# Altium schematic sheet MCU.SchDoc
size A4; SheetNumber: 4; SheetTotal: 9
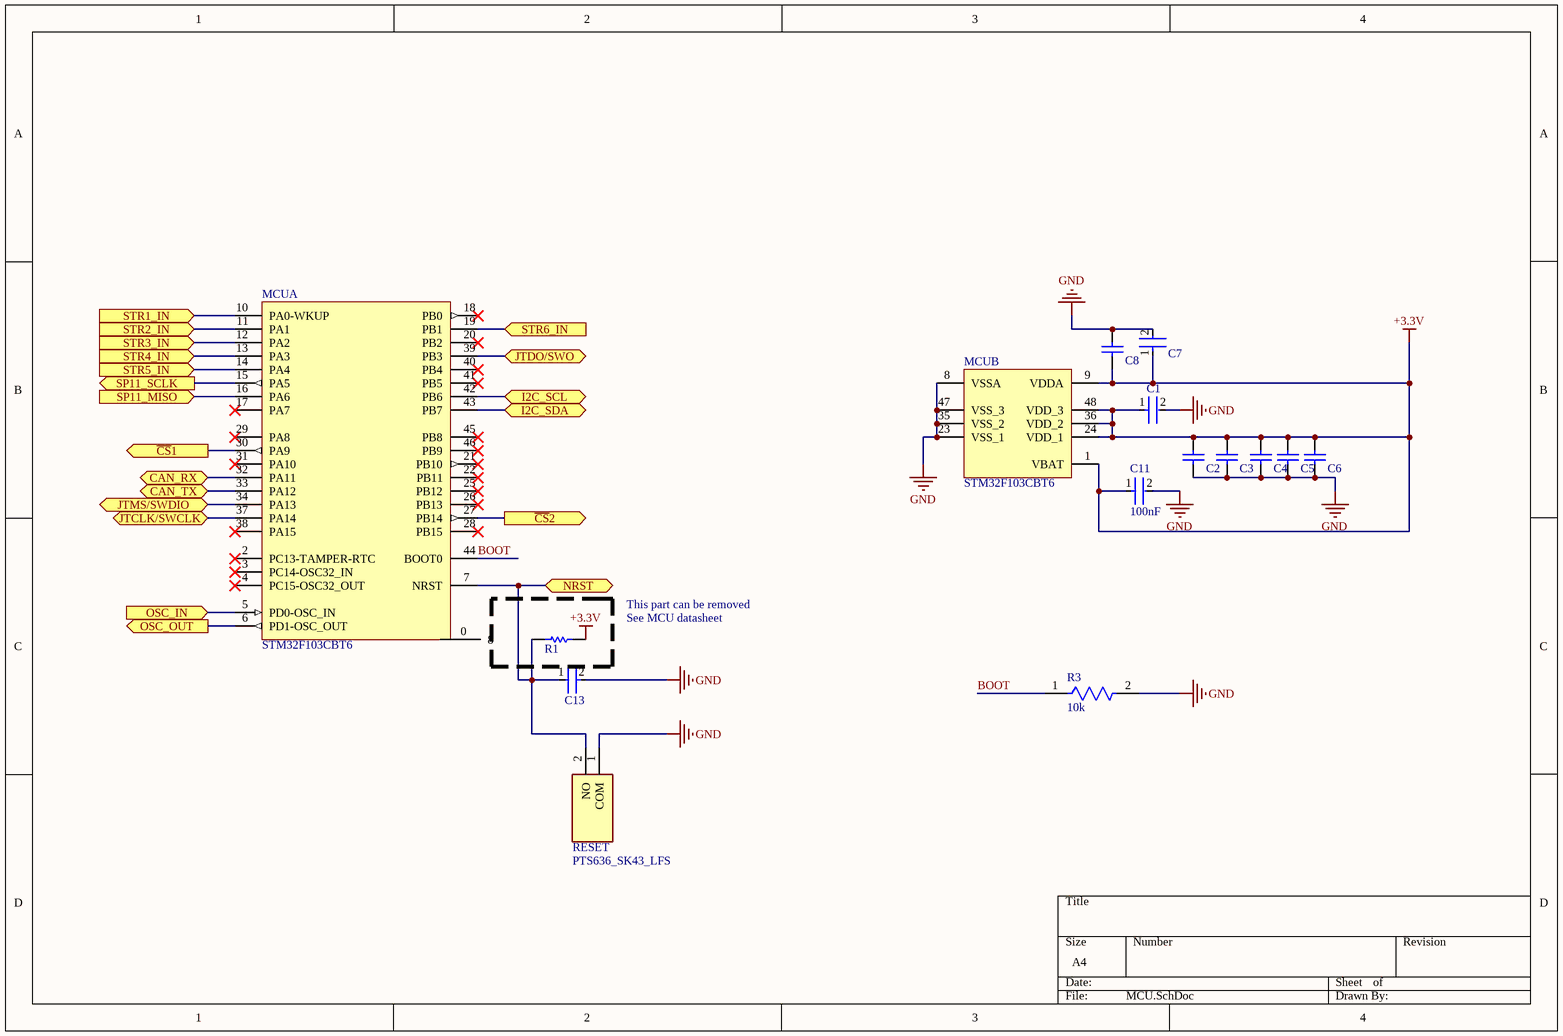
[diagram p0: MCU.SchDoc]

## Parts
C1  GRM155R60J475ME47D  [FP-GRM155-0_1-IPC_B]  (value not drawn)
C2  08051C104KAT2A  [CAPC2013X94X50ML20T25]  (value not drawn)
C3  08051C104KAT2A  [CAPC2013X94X50ML20T25]  (value not drawn)
C4  08051C104KAT2A  [CAPC2013X94X50ML20T25]  (value not drawn)
C5  08051C104KAT2A  [CAPC2013X94X50ML20T25]  (value not drawn)
C6  08051C104KAT2A  [CAPC2013X94X50ML20T25]  (value not drawn)
C7  GRM155R61A105KE15D  [FP-GRM15-0_1-MFG]  (value not drawn)
C8  08051C104KAT2A  [CAPC2013X94X50ML20T25]  (value not drawn)
C11  100nF  [FP-C0402-BB-MFG]
C13  GRM155R71C104KA88D  [FP-GRM15-MFG]  (value not drawn)
MCU  STM32F103CBT6  [STM-LQFP48_L]  (parts A,B of 2)
R1  CRCW12064K70FKEA  [RESC3216X60X45ML15T20]  (value not drawn)
R3  10k  [FP-CRCW0402-e3-IPC_B]
RESET  PTS636_SK43_LFS  [PTS636SK43LFS]

## Ports
CAN_RX (bidir), CAN_TX (bidir), I2C_SCL (bidir), I2C_SDA (bidir), JTCLK/SWCLK (bidir), JTDO/SWO (bidir), JTMS/SWDIO (bidir), NRST (bidir), OSC_IN (in), OSC_OUT (out), SP11_MISO (in), SP11_SCLK (out), STR1_IN (in), STR2_IN (in), STR3_IN (in), STR4_IN (in), STR5_IN (in), STR6_IN (in), ~{CS}1 (out), ~{CS}2 (out)

## Nets
+3.3V: C1.1 C2.2 C3.2 C4.2 C5.2 C6.2 C7.1 C8.2 C11.1 MCU.1(VBAT) MCU.9(VDDA) MCU.24(VDD_1) MCU.36(VDD_2) MCU.48(VDD_3) R1.2
GND: C1.2 C2.1 C3.1 C4.1 C5.1 C6.1 C7.2 C8.1 C11.2 C13.2 MCU.8(VSSA) MCU.23(VSS_1) MCU.35(VSS_2) MCU.47(VSS_3) R3.2 RESET.1(COM)
~{CS}1: MCU.30(PA9) ; port ~{CS}1
~{CS}2: MCU.27(PB14) ; port ~{CS}2
BOOT: MCU.44(BOOT0) R3.1
CAN_RX: MCU.32(PA11) ; port CAN_RX
CAN_TX: MCU.33(PA12) ; port CAN_TX
I2C_SCL: MCU.42(PB6) ; port I2C_SCL
I2C_SDA: MCU.43(PB7) ; port I2C_SDA
JTCLK/SWCLK: MCU.37(PA14) ; port JTCLK/SWCLK
JTDO/SWO: MCU.39(PB3) ; port JTDO/SWO
JTMS/SWDIO: MCU.34(PA13) ; port JTMS/SWDIO
NRST: C13.1 MCU.7(NRST) R1.1 RESET.2(NO) ; port NRST
OSC_IN: MCU.5(PD0-OSC_IN) ; port OSC_IN
OSC_OUT: MCU.6(PD1-OSC_OUT) ; port OSC_OUT
SP11_MISO: MCU.16(PA6) ; port SP11_MISO
SP11_SCLK: MCU.15(PA5) ; port SP11_SCLK
STR1_IN: MCU.10(PA0-WKUP) ; port STR1_IN
STR2_IN: MCU.11(PA1) ; port STR2_IN
STR3_IN: MCU.12(PA2) ; port STR3_IN
STR4_IN: MCU.13(PA3) ; port STR4_IN
STR5_IN: MCU.14(PA4) ; port STR5_IN
STR6_IN: MCU.19(PB1) ; port STR6_IN

Not connected (* = marked no-connect by the designer): MCU 0(8) 2(PC13-TAMPER-RTC)* 3(PC14-OSC32_IN)* 4(PC15-OSC32_OUT)* 17(PA7)* 18(PB0)* 20(PB2)* 21(PB10)* 22(PB11)* 25(PB12)* 26(PB13)* 28(PB15)* 29(PA8)* 31(PA10)* 38(PA15)* 40(PB4)* 41(PB5)* 45(PB8)* 46(PB9)*

## Notes on the sheet
- This part can be removed
- See MCU datasheet

## Library data of the parts
C1 = CMP-2008-04549-2: Chip Multilayer Ceramic Capacitors for General Purpose, 0402, 4.7uF, X5R, 15%, 20%, 6.3V; Height: 0.5mm; Weight: 0.000212oz; Length: 1mm; Case Code (Metric): 1005; Packaging: Tape and Reel; Termination: SMD/SMT; Dielectric: X5R; Depth: 0.5mm; Case Code (Imperial): 0402; Min Operating Temperature: -55°C; Case/Package: 0402; Voltage: 6.3V; Width: 0.02inch; Capacitance: 4.7uF; Lead Free: Lead Free; Thickness: 0.022inch; Contact Plating: Tin; REACH SVHC: No SVHC; Package Quantity: 10000; Tolerance: 20%; Voltage Rating (DC): 6.3V; Voltage Rating: 6.3V; Mount: Surface Mount; Max Operating Temperature: 85°C
C2-C6 C8 = CMP-2007-04174-1: Manufacturer: AVX Interconnect / Elco; Part Number: 08051C104KAT2A
C7 = CMP-2008-04556-2: CAP CER 1UF 10V X5R 0402; Manufacturer: Murata; Material: Ceramic; Tolerance: 10%; Temperature Coefficient: 15%; Octopart: https://octopart.com/grm155r61a105ke15d-murata-197442; Manufacturer Part Number: GRM155R61A105KE15D; Lead Free: Yes; ComponentLink2Description: Datasheet; Temperature: -55°C to +85°C; Temperature Range High: +85°C; Height: 0.55mm; Capacitance: 1uF; Ipc Land Pattern Name: CAPC10050X50; ComponentLink2URL: https://search.murata.co.jp/Ceramy/image/img/A01X/G101/ENG/GRM155R61A105KE15-01A.pdf; Temperature Range Low: -55°C; Device Class L2: Capacitors; Voltage Rating: 10V; RoHS: TRUE; Device Class L1: Passive Components; Device Class L3: Ceramic Capacitors; Temperature Characteristic: X5R; Mouser Description: 0402 1 uF 10 V ±10% Tolerance X5R Surface Mount Multilayer Ceramic Capacitor; Automotive: No; Package: GRM15-0.1; Digikey Description: CAP CER 1UF 10V X5R 0402; Value: 1uF; Category: Cap
C11 = CMP-2008-02046-2: CAP CER 0.1UF 10V X5R 0402; Manufacturer: Kemet; Manufacturer Part Number: C0402C104K8PACTU; Material: Ceramic; Capacitance: 0.10 μF; Temperature Coefficient: 15%; Tolerance: 0.1; Value: 0.10 μF; Package: C0402-BB; Temperature: -55°C to +125°C; ComponentLink2Description: Datasheet; Temperature Characteristic: X5R; Device Class L1: Passive Components; Height: 0.55mm; Lead Free: Yes; ComponentLink2URL: https://content.kemet.com/datasheets/KEM_C1002_X7R_SMD.pdf; Device Class L2: Capacitors; Temperature Range Low: -55°C; Temperature Range High: +125°C; RoHS: TRUE; Octopart: https://octopart.com/c0402c104k8pactu-kemet-140039; Automotive: No; Mouser Description: Capacitor 100 nF 10 VDC 0402; Category: Cap; Voltage Rating: 10 V; Digikey Description: CAP CER 0.1UF 10V X5R 0402; Ipc Land Pattern Name: CAPC10050X50; Device Class L3: Ceramic Capacitors
C13 = CMP-2100-03641-2: CAP CER 0.1UF 16V X7R 0402; Manufacturer: Murata; Standoff Height: 0mm; Tolerance: 10%; Voltage Rating: 16Vdc; Material: Ceramic; Capacitance: 0.10μF; Value: 0.10μF; RoHS: TRUE; Manufacturer Part Number: GRM155R71C104KA88D; Temperature Characteristic: X7R; Octopart: https://octopart.com/grm155r71c104ka88d-murata-196880; Digikey Description: CAP CER 0.1UF 16V X7R 0402; Device Class L3: Ceramic Capacitors; Height: 0.55mm; ComponentLink2Description: Datasheet; Temperature Range Low: -55°C; Ipc Land Pattern Name: CAPC10050X219; ComponentLink2URL: https://search.murata.co.jp/Ceramy/image/img/A01X/G101/ENG/GRM155R71H471KA01-01A.pdf; Device Class L1: Passive Components; Lead Free: yes; Category: Cap; Package: GRM15; Temperature: -55°C to +125°C; Device Class L2: Capacitors; Temperature Range High: +125°C; Mouser Description: 0402 0.1 uF 16V ±10 % Tolerance X7R SMT Multilayer Ceramic Capacitor
MCU = CMP-0237-00250-3: ARM Cortex-M3 32-bit MCU, 128 KB Flash, 20 KB Internal RAM, 37 I/Os, 48-pin LQFP, -40 to 85 degC, Tray; Supply Voltage(Vcc) min (V): 2; Operating Frequency(F) (Processor speed) (MHz): 72; A/D Converter: 2x12-bit (10 Channel); FLASH Size (Prog) (kB): 128; Internal RAM Size (kB): 20; I/Os (High Current): 37; ComponentLink2Description: Datasheet; PackageReference: LQFP48; PartNumber: STM32F103CBT6; ComponentLink1Description: Manufacturer URL; DatasheetVersion: Rev. 16; PackageVersion: Rev. 6, 06/2013; Packing: Tray; ComponentLink1URL: http://www.st.com/web/en/home.html; Mounting Technology: Surface Mount; ComponentLink3URL: http://www.st.com/st-web-ui/static/active/en/resource/technical/document/datasheet/DM00058181.pdf; PackageDescription: 48-Pin Low Profile Quad Flat Package, 7 x 7 mm Body, 0.5 mm Pitch; Core: ARM Cortex-M3; ComponentLink3Description: Package Specification; ComponentLink2URL: http://www.st.com/st-web-ui/static/active/en/resource/technical/document/datasheet/CD00161566.pdf
R1 = CMP-2100-03618-1: Chip Resistor, 4.7 KOhm, +/- 1%, 0.25 W, -55 to 155 degC, 1206 (3216 Metric), RoHS, Tape and Reel; Manufacturer: Vishay Semiconductor; Power Rating: 250mW; Voltage Rating: 200V; Temperature Coefficient: 100ppm/degreesC; Package Quantity: 10; Composition: ThickFilm; REACH SVHC: Unknown; Mount: SurfaceMount; Max Operating Temperature: 155degC; Length: 3.2mm; Number of Terminations: 2; Case Code (Metric): 3216; Military Standard: Not; Width: 1.6mm; Datasheet Version: 41061.0; Max Power Dissipation: 250mW; Datasheet URL: http://www.vishay.com/docs/20035/dcrcwe3.pdf; Contact Plating: Tin; Case/Package: 1206; Height: 0.55mm; Package Reference: 1206.0; Lead Free: LeadFree; Weight: 0.000353oz; Package Description: 2-Pin Surface Mount Device, Body 3.15 x 1.6 mm; Min Operating Temperature: -55degC; Resistance: 4.7KOhm; Packaging: TapeandReel; Depth: 1.6mm; Tolerance: 1%; RoHSCompliant: true; Termination: SMD/SMT; Case Code (Imperial): 1206; Voltage Rating (DC): 200V; Radiation Hardening: No; Manufacturer URL: http://www.vishay.com/
R3 = CMP-2002-08135-2: RES SMD 10K OHM 1% 1/16W 0402; Power Rating: 63mW; Resistance: 10kR; Voltage Rating: 50V; Temperature Coefficient: 100ppm/°C; Case Code (Metric): 1005; Features: Automotive AEC-Q200; Termination: SMD/SMT; Mount: Surface Mount; Package Quantity: 10; Packaging: Tape and Reel; Case Code (Imperial): 0402; Weight: 2.3E-05oz; Lead Free: Lead Free; Width: 0.02inch; Max Power Dissipation: 63mW; Tolerance: 1%; Number of Terminations: 2; Height: 0.35mm; Number of Pins: 2; Composition: Thick Film; Length: 1mm; Voltage Rating (DC): 50V; Case/Package: 0402; Radiation Hardening: No; Contact Plating: Tin; Depth: 0.5mm; Military Standard: Not; Min Operating Temperature: -55°C; Max Operating Temperature: 155°C
RESET = PTS636_SK43_LFS: Switch; Manufacturer_Name: C & K COMPONENTS; Manufacturer_Part_Number: PTS636 SK43 LFS; Datasheet Link: https://componentsearchengine.com/Datasheets/1/PTS636 SK43 LFS.pdf; Height: 4.5mm